# EAGLE schematic board (EAGLE 6.4)
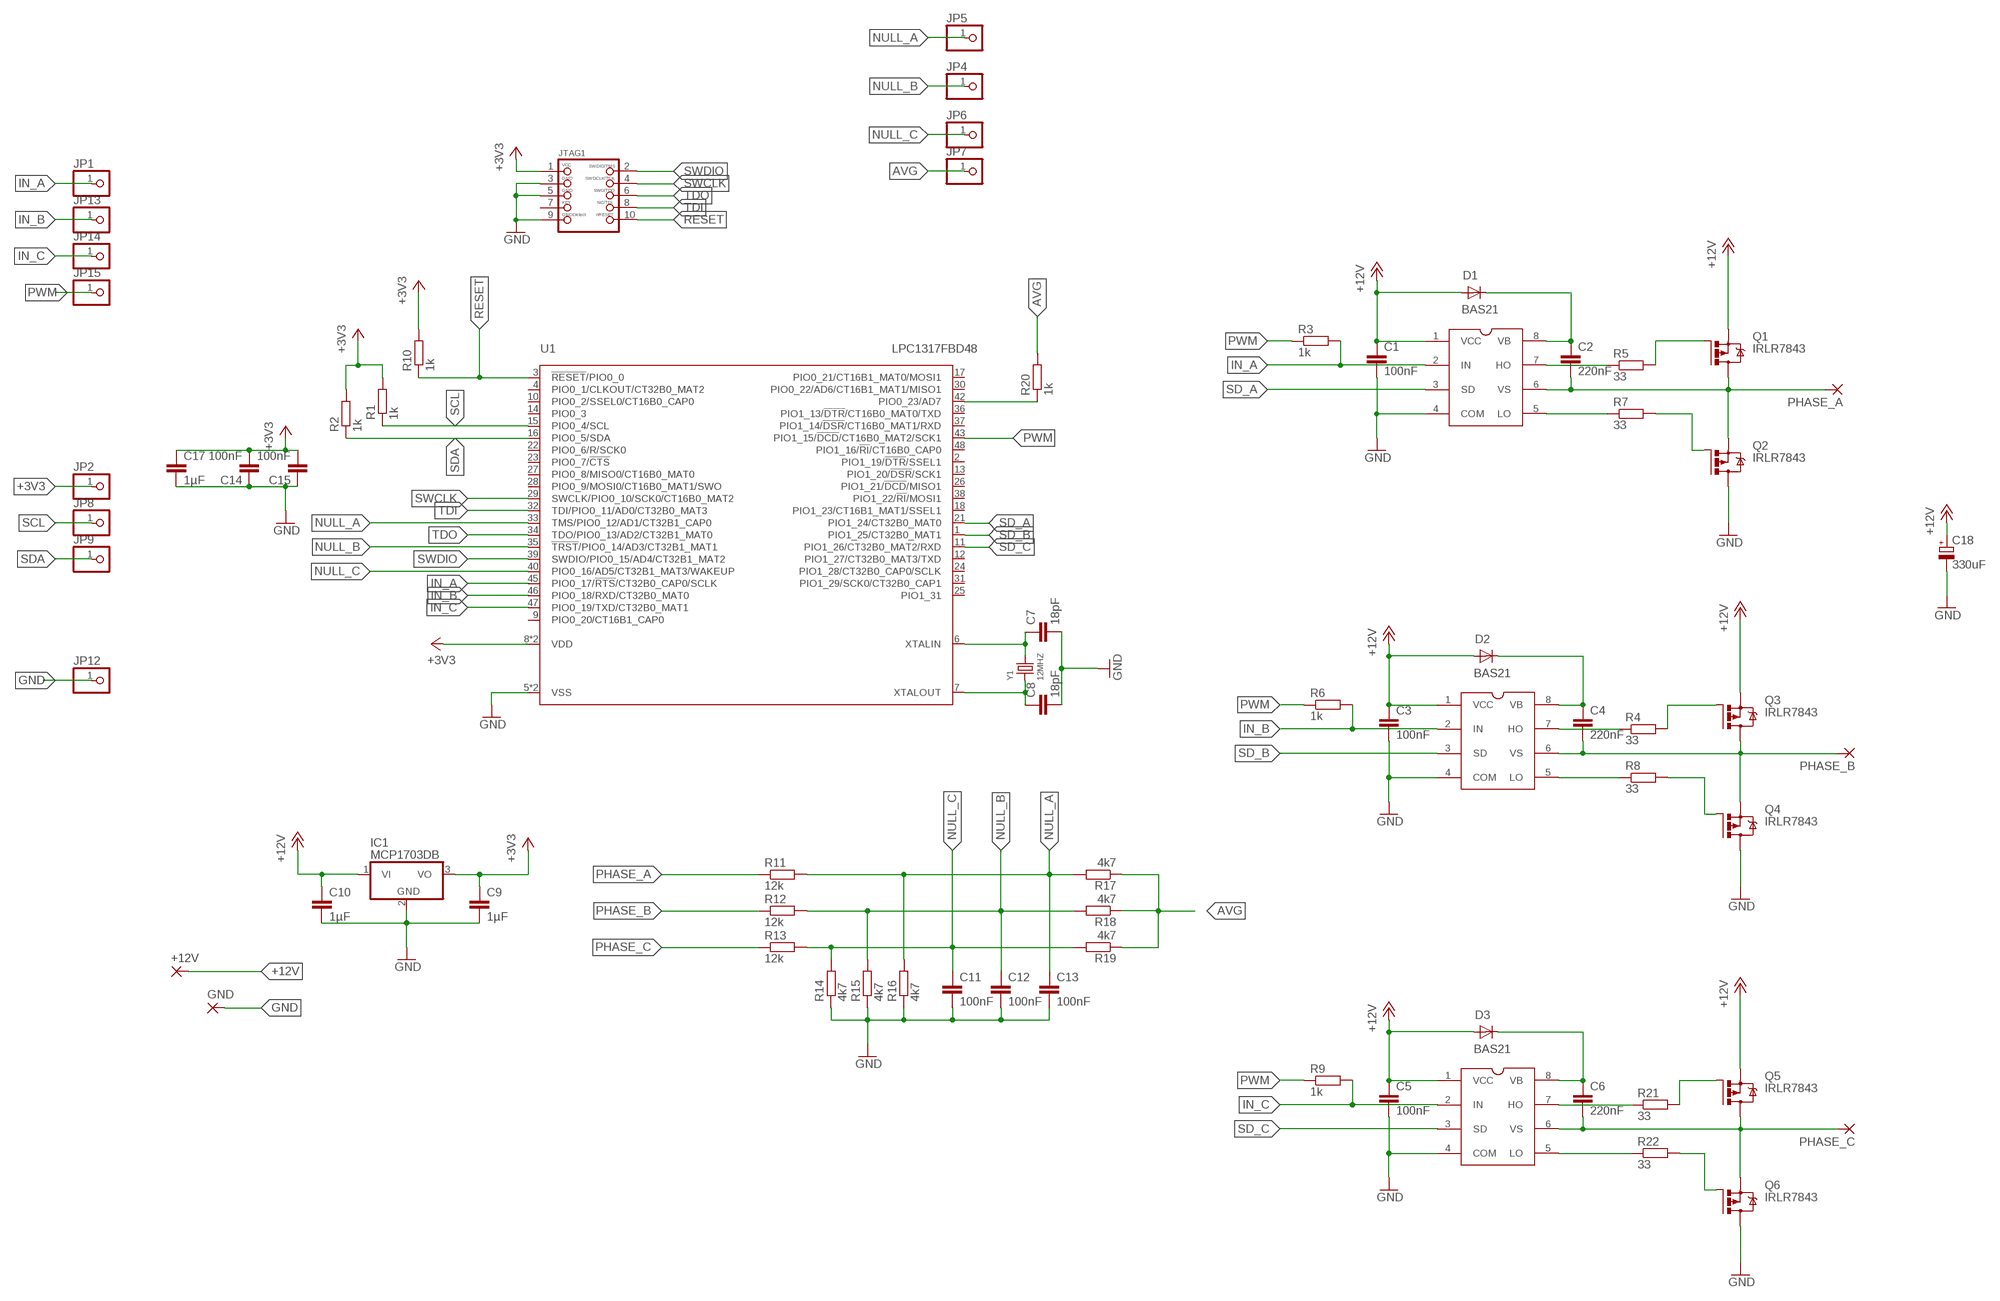
[diagram p0: schematic, sheet 1]

## Parts
+12V  SMD5  [SMD2,54-5,08]
C1  100nF  C-EUC0603  [C0603]
C2  220nF  C-EUC0603  [C0603]
C3  100nF  C-EUC0603  [C0603]
C4  220nF  C-EUC0603  [C0603]
C5  100nF  C-EUC0603  [C0603]
C6  220nF  C-EUC0603  [C0603]
C7  18pF  C-EUC0603  [C0603]
C8  18pF  C-EUC0603  [C0603]
C9  1µF  C-EUC0603  [C0603]
C10  1µF  C-EUC0603  [C0603]
C11  100nF  C-EUC0603  [C0603]
C12  100nF  C-EUC0603  [C0603]
C13  100nF  C-EUC0603  [C0603]
C14  100nF  C-EUC0603  [C0603]
C15  100nF  C-EUC0603  [C0603]
C17  1µF  C-EUC0603  [C0603]
C18  330uF  CPOL-EUE5-10.5  [E5-10,5]
D1  BAS21  [SOT23]
D2  BAS21  [SOT23]
D3  BAS21  [SOT23]
GND  SMD5  [SMD2,54-5,08]
IC1  MCP1703DB  [SOT223]
JP1  PINHD-1X1  [1X01]
JP2  PINHD-1X1  [1X01]
JP4  PINHD-1X1  [1X01]
JP5  PINHD-1X1  [1X01]
JP6  PINHD-1X1  [1X01]
JP7  PINHD-1X1  [1X01]
JP8  PINHD-1X1  [1X01]
JP9  PINHD-1X1  [1X01]
JP12  PINHD-1X1  [1X01]
JP13  PINHD-1X1  [1X01]
JP14  PINHD-1X1  [1X01]
JP15  PINHD-1X1  [1X01]
JTAG1  JTAG-CORTEXM3  [2X05_1.27MM_SMT]
PHASE_A  SMD5  [SMD2,54-5,08]
PHASE_B  SMD5  [SMD2,54-5,08]
PHASE_C  SMD5  [SMD2,54-5,08]
Q1  IRLR7843  IRFR5305  [D-PAK_TO252AA]
Q2  IRLR7843  IRFR5305  [D-PAK_TO252AA]
Q3  IRLR7843  IRFR5305  [D-PAK_TO252AA]
Q4  IRLR7843  IRFR5305  [D-PAK_TO252AA]
Q5  IRLR7843  IRFR5305  [D-PAK_TO252AA]
Q6  IRLR7843  IRFR5305  [D-PAK_TO252AA]
R1  1k  R-EU_R0603  [R0603]
R2  1k  R-EU_R0603  [R0603]
R3  1k  R-EU_R0603  [R0603]
R4  33  R-EU_R0603  [R0603]
R5  33  R-EU_R0603  [R0603]
R6  1k  R-EU_R0603  [R0603]
R7  33  R-EU_R0603  [R0603]
R8  33  R-EU_R0603  [R0603]
R9  1k  R-EU_R0603  [R0603]
R10  1k  R-EU_R0603  [R0603]
R11  12k  R-EU_R0603  [R0603]
R12  12k  R-EU_R0603  [R0603]
R13  12k  R-EU_R0603  [R0603]
R14  4k7  R-EU_R0603  [R0603]
R15  4k7  R-EU_R0603  [R0603]
R16  4k7  R-EU_R0603  [R0603]
R17  4k7  R-EU_R0603  [R0603]
R18  4k7  R-EU_R0603  [R0603]
R19  4k7  R-EU_R0603  [R0603]
R20  1k  R-EU_R0603  [R0603]
R21  33  R-EU_R0603  [R0603]
R22  33  R-EU_R0603  [R0603]
U1  LPC1317FBD48  [SOT313-2]
U$1  IR2104S  [IR2104S]
U$2  IR2104S  [IR2104S]
U$3  IR2104S  [IR2104S]
Y1  12MHZ  CRYSTALTHIN  [CRYSTAL_3.2X2.5]

## Nets
+3V3: C9.1 C14.2 C15.2 C17.1 IC1.3(VO) JP2.1 JTAG1.1 R1.2 R2.2 R10.2 U1.8(VDD) U1.44(VDD)
+12V: +12V.1(P) C1.1 C3.1 C5.1 C10.1 C18.+ D1.1(A) D2.1(A) D3.1(A) IC1.1(VI) Q1.3(S) Q3.3(S) Q5.3(S) U$1.1(VCC) U$2.1(VCC) U$3.1(VCC)
AVG: JP7.1 R17.1 R18.1 R19.1 R20.2
GND: C1.2 C3.2 C5.2 C7.2 C8.2 C9.2 C10.2 C11.2 C12.2 C13.2 C14.1 C15.1 C17.2 C18.- GND.1(P) IC1.2(GND) JP12.1 JTAG1.3 JTAG1.5 JTAG1.9 Q2.4(D) Q4.4(D) Q6.4(D) R14.1 R15.1 R16.1 U1.5(VSS) U1.41(VSS) U$1.4(COM) U$2.4(COM) U$3.4(COM)
IN_A: JP1.1 R3.2 U1.45(PIO0_17/!RTS!/CT32B0_CAP0/SCLK) U$1.2(IN)
IN_B: JP13.1 R6.2 U1.46(PIO0_18/RXD/CT32B0_MAT0) U$2.2(IN)
IN_C: JP14.1 R9.2 U1.47(PIO0_19/TXD/CT32B0_MAT1) U$3.2(IN)
N$1: Q1.1(G) R5.2
N$2: Q2.1(G) R7.2
N$3: R21.1 U$3.7(HO)
N$4: Q5.1(G) R21.2
N$5: R20.1 U1.42(PIO0_23/AD7)
N$6: C7.1 U1.6(XTALIN) Y1.2
N$7: C8.1 U1.7(XTALOUT) Y1.1
N$8: R4.1 U$2.7(HO)
N$10: C2.1 D1.3(K) U$1.8(VB)
N$11: Q4.1(G) R8.2
N$12: R22.1 U$3.5(LO)
N$13: Q3.1(G) R4.2
N$14: R8.1 U$2.5(LO)
N$15: R7.1 U$1.5(LO)
N$16: R5.1 U$1.7(HO)
N$17: C4.1 D2.3(K) U$2.8(VB)
N$20: Q6.1(G) R22.2
N$26: C6.1 D3.3(K) U$3.8(VB)
NULL_A: C13.1 JP5.1 R11.2 R16.2 R17.2 U1.33(TMS/PIO0_12/AD1/CT32B1_CAP0)
NULL_B: C12.1 JP4.1 R12.2 R15.2 R18.2 U1.35(!TRST!/PIO0_14/AD3/CT32B1_MAT1)
NULL_C: C11.1 JP6.1 R13.2 R14.2 R19.2 U1.40(PIO0_16/AD5/CT32B1_MAT3/WAKEUP)
PHASE_A: C2.2 PHASE_A.1(P) Q1.4(D) Q2.3(S) R11.1 U$1.6(VS)
PHASE_B: C4.2 PHASE_B.1(P) Q3.4(D) Q4.3(S) R12.1 U$2.6(VS)
PHASE_C: C6.2 PHASE_C.1(P) Q5.4(D) Q6.3(S) R13.1 U$3.6(VS)
PWM: JP15.1 R3.1 R6.1 R9.1 U1.43(PIO1_15/!DCD!/CT16B0_MAT2/SCK1)
RESET: JTAG1.10 R10.1 U1.3(!RESET!/PIO0_0)
SCL: JP8.1 R1.1 U1.15(PIO0_4/SCL)
SD_A: U1.21(PIO1_24/CT32B0_MAT0) U$1.3(SD)
SD_B: U1.1(PIO1_25/CT32B0_MAT1) U$2.3(SD)
SD_C: U1.11(PIO1_26/CT32B0_MAT2/RXD) U$3.3(SD)
SDA: JP9.1 R2.1 U1.16(PIO0_5/SDA)
SWCLK: JTAG1.4 U1.29(SWCLK/PIO0_10/SCK0/CT16B0_MAT2)
SWDIO: JTAG1.2 U1.39(SWDIO/PIO0_15/AD4/CT32B1_MAT2)
TDI: JTAG1.8 U1.32(TDI/PIO0_11/AD0/CT32B0_MAT3)
TDO: JTAG1.6 U1.34(TDO/PIO0_13/AD2/CT32B1_MAT0)
Unconnected: JTAG1.7 U1.2(PIO1_19/!DTR!/SSEL1) U1.4(PIO0_1/CLKOUT/CT32B0_MAT2) U1.9(PIO0_20/CT16B1_CAP0) U1.10(PIO0_2/SSEL0/CT16B0_CAP0) U1.12(PIO1_27/CT32B0_MAT3/TXD) U1.13(PIO1_20/!DSR!/SCK1) U1.14(PIO0_3) U1.17(PIO0_21/CT16B1_MAT0/MOSI1) U1.18(PIO1_23/CT16B1_MAT1/SSEL1) U1.22(PIO0_6/R/SCK0) U1.23(PIO0_7/!CTS!) U1.24(PIO1_28/CT32B0_CAP0/SCLK) U1.25(PIO1_31) U1.26(PIO1_21/!DCD!/MISO1) U1.27(PIO0_8/MISO0/CT16B0_MAT0) U1.28(PIO0_9/MOSI0/CT16B0_MAT1/SWO) U1.30(PIO0_22/AD6/CT16B1_MAT1/MISO1) U1.31(PIO1_29/SCK0/CT32B0_CAP1) U1.36(PIO1_13/!DTR!/CT16B0_MAT0/TXD) U1.37(PIO1_14/!DSR!/CT16B0_MAT1/RXD) U1.38(PIO1_22/!RI!/MOSI1) U1.48(PIO1_16/!RI!/CT16B0_CAP0)

## Library data of the parts
+12V GND PHASE_A PHASE_B PHASE_C = wirepad:SMD5: SMD PAD
C1-C15 C17 = resistor:C-EU: CAPACITOR, European symbol
C18 = rcl:CPOL-EU: POLARIZED CAPACITOR, European symbol
D1-D3 = nxp_60_1_1:BAS21: General purpose diode The BAS19, BAS20 and BAS21 are general purpose diodes fabricated in planar technology, and encapsulated in a small SOT23 plastic SMD package. AAL Eindhoven MK
IC1 = linear:MCP1703: 250 mA, 16V, Low Quiescent Current LDO Regulator Source: http://ww1.microchip.com/downloads/en/DeviceDoc/22049b.pdf
JP1 JP2 JP4-JP9 JP12-JP15 = pinhead:PINHD-1X1: PIN HEADER
JTAG1 = microbuilder:JTAG-CORTEXM3: Serial Wire (SW-DP) Connector This standard 0.05" 10-pin connector is for use with the Cortex M0/M3's native SWD (serial wire debugger) interface (SW-DP). Some boards support a 20-pin combined JTAG+SWD connector (SWJ-DP), such as the LPC1700 family, but many smaller devices only work with SWD which typically use the smaller 10-pin SW-DP connecter (the LPC1300 family, for example, only supports SWD). 2x05 1.27mm/0.05" Connector: This is the standard SMT connector defined by ARM for all Cortex devices, and should be used in most situations and for forward-compatibility since any new devices coming to market will likely use this connector. MOLEX 10 Pin 0.1" Connector: This 0.1" 10 pin connector has the same pin layout as the standard 0.05" connector, but is easier to work with if you are using standard jumper wires or custom cables to connect your SWD hardware. MOLEX 20 Pin 0.1" Connector: This 0.1" 20 pin connector is the same model used for ARM7/ARM9 JTAG debuggers, but is connected to match the pins on the Segger J-Link for ARM (which supports both JTAG and SWD debugging). See the following document from ARM for more information on Cortex M3 Debug Connectors: http://infocenter.arm.com/help/topic/com.arm.doc.faqs/attached/13634/cortex_debug_connectors.pdf And the following page for an overview with images of the different connector types: http://www.keil.com/peripherals/coresight/connectors.asp
Q1-Q6 = transistor-power:IRF?5305: HEXFET Power MOSFET Source: http://www.irf.com/product-info/datasheets/data/irfr5305pbf.pdf
R1-R22 = resistor:R-EU_: RESISTOR, European symbol
U1 = nxp_60_1_1:LPC1317FBD48: 32-bit ARM Cortex-M3 microcontroller; up to 64 kB flash; up to 12 kB SRAM; USB device; USART; EEPROM The LPC1315/16/17/45/46/47 are ARM Cortex-M3 based microcontrollers for embedded applications featuring a high level of integration and low power consumption. The ARM Cortex-M3 is a next generation core that offers system enhancements such as enhanced debug features and a higher level of support block integration. The LPC1315/16/17/45/46/47 operate at CPU frequencies of up to 72 MHz. The ARM Cortex-M3 CPU incorporates a 3-stage pipeline and uses a Harvard architecture with separate local instruction and data buses as well as a third bus for peripherals. The ARM Cortex-M3 CPU also includes an internal prefetch unit that supports speculative branching. Equipped with a highly flexible and configurable Full-Speed USB 2.0 device controller available on the LPC1345/46/47, this series brings unparalleled design flexibility and seamless integration to today’s demanding connectivity solutions. The peripheral complement of the LPC1315/16/17/45/46/47 includes up to 64 kB of flash memory, 8 kB or 10 kB of SRAM data memory, one Fast-mode Plus I 2 C-bus interface, one RS-485/EIA-485 USART with support for synchronous mode and smart card interface, two SSP interfaces, four general purpose counter/timers, an 8-channel, 12-bit ADC, and up to 51 general purpose I/O pins. AAL Eindhoven MK; EEPROM: 4kB; FLASH: 64kB; GPIO: 40; SRAM0: 8kB; SRAM1: 2kB; SRAM_USB: -; USB: -
U$1-U$3 = ir-2104:IR2104S: Half Bridge Mosfet - IGBT driver SOIC
Y1 = microbuilder:CRYSTAL: Crystals HC49UP - Surface Mount Crystal 4.0MHz 18pF +/-30ppm Surface Mount Crystal [Digikey: 535-9857-1-ND] 12.0 MHz Surface Mount Crystal [Digikey: 535-9869-6-ND] 25.0 MHz Surface Mount Crystal [Digikey: 535-9078-1-ND] 3.2 x 2.5mm - MEMs SMT Crystal 12.0 MHz 8pF 15ppm 3.2 x 2.5mm Crystal [Digikey: -10-70°C: 644-1047-1-ND -40-125°C: 644-1128-1-ND] 16.0 MHz 8pF 15ppm 3.2 x 2.5mm Crystal [Digikey: -10-70°C: 644-1049-1-ND -40-125°C: 644-1129-2-ND] 16.0 MHz 10pF 10ppm 3.2 x 2.5mm Crystal [Digikey: 644-1100-1-ND] 27.12 MHz 18pF 30ppm 3.2 x 2.5mm Crystal [Digikey: 887-1424-1-ND] 27.12MHz 10pF 10ppm 3.2 x 2.5mm Crystal [Digikey: 887-1329-1-ND] 4.9 x 1.8mm - MEMs SMT Crystal 32.768 KHz 12.5pF 20ppm 4.9 x 1.8mm Crystal [Digikey: SE2415CT-ND] Cylinder 32.768KHz Cylinder Crystal